# Altium schematic sheet Interface_gratis.SchDoc: CONTROLADORA MAIS PIPOCA - REVISÃO EMC
size A3; DocumentNumber: GA0078; SheetNumber: 17; SheetTotal: 17
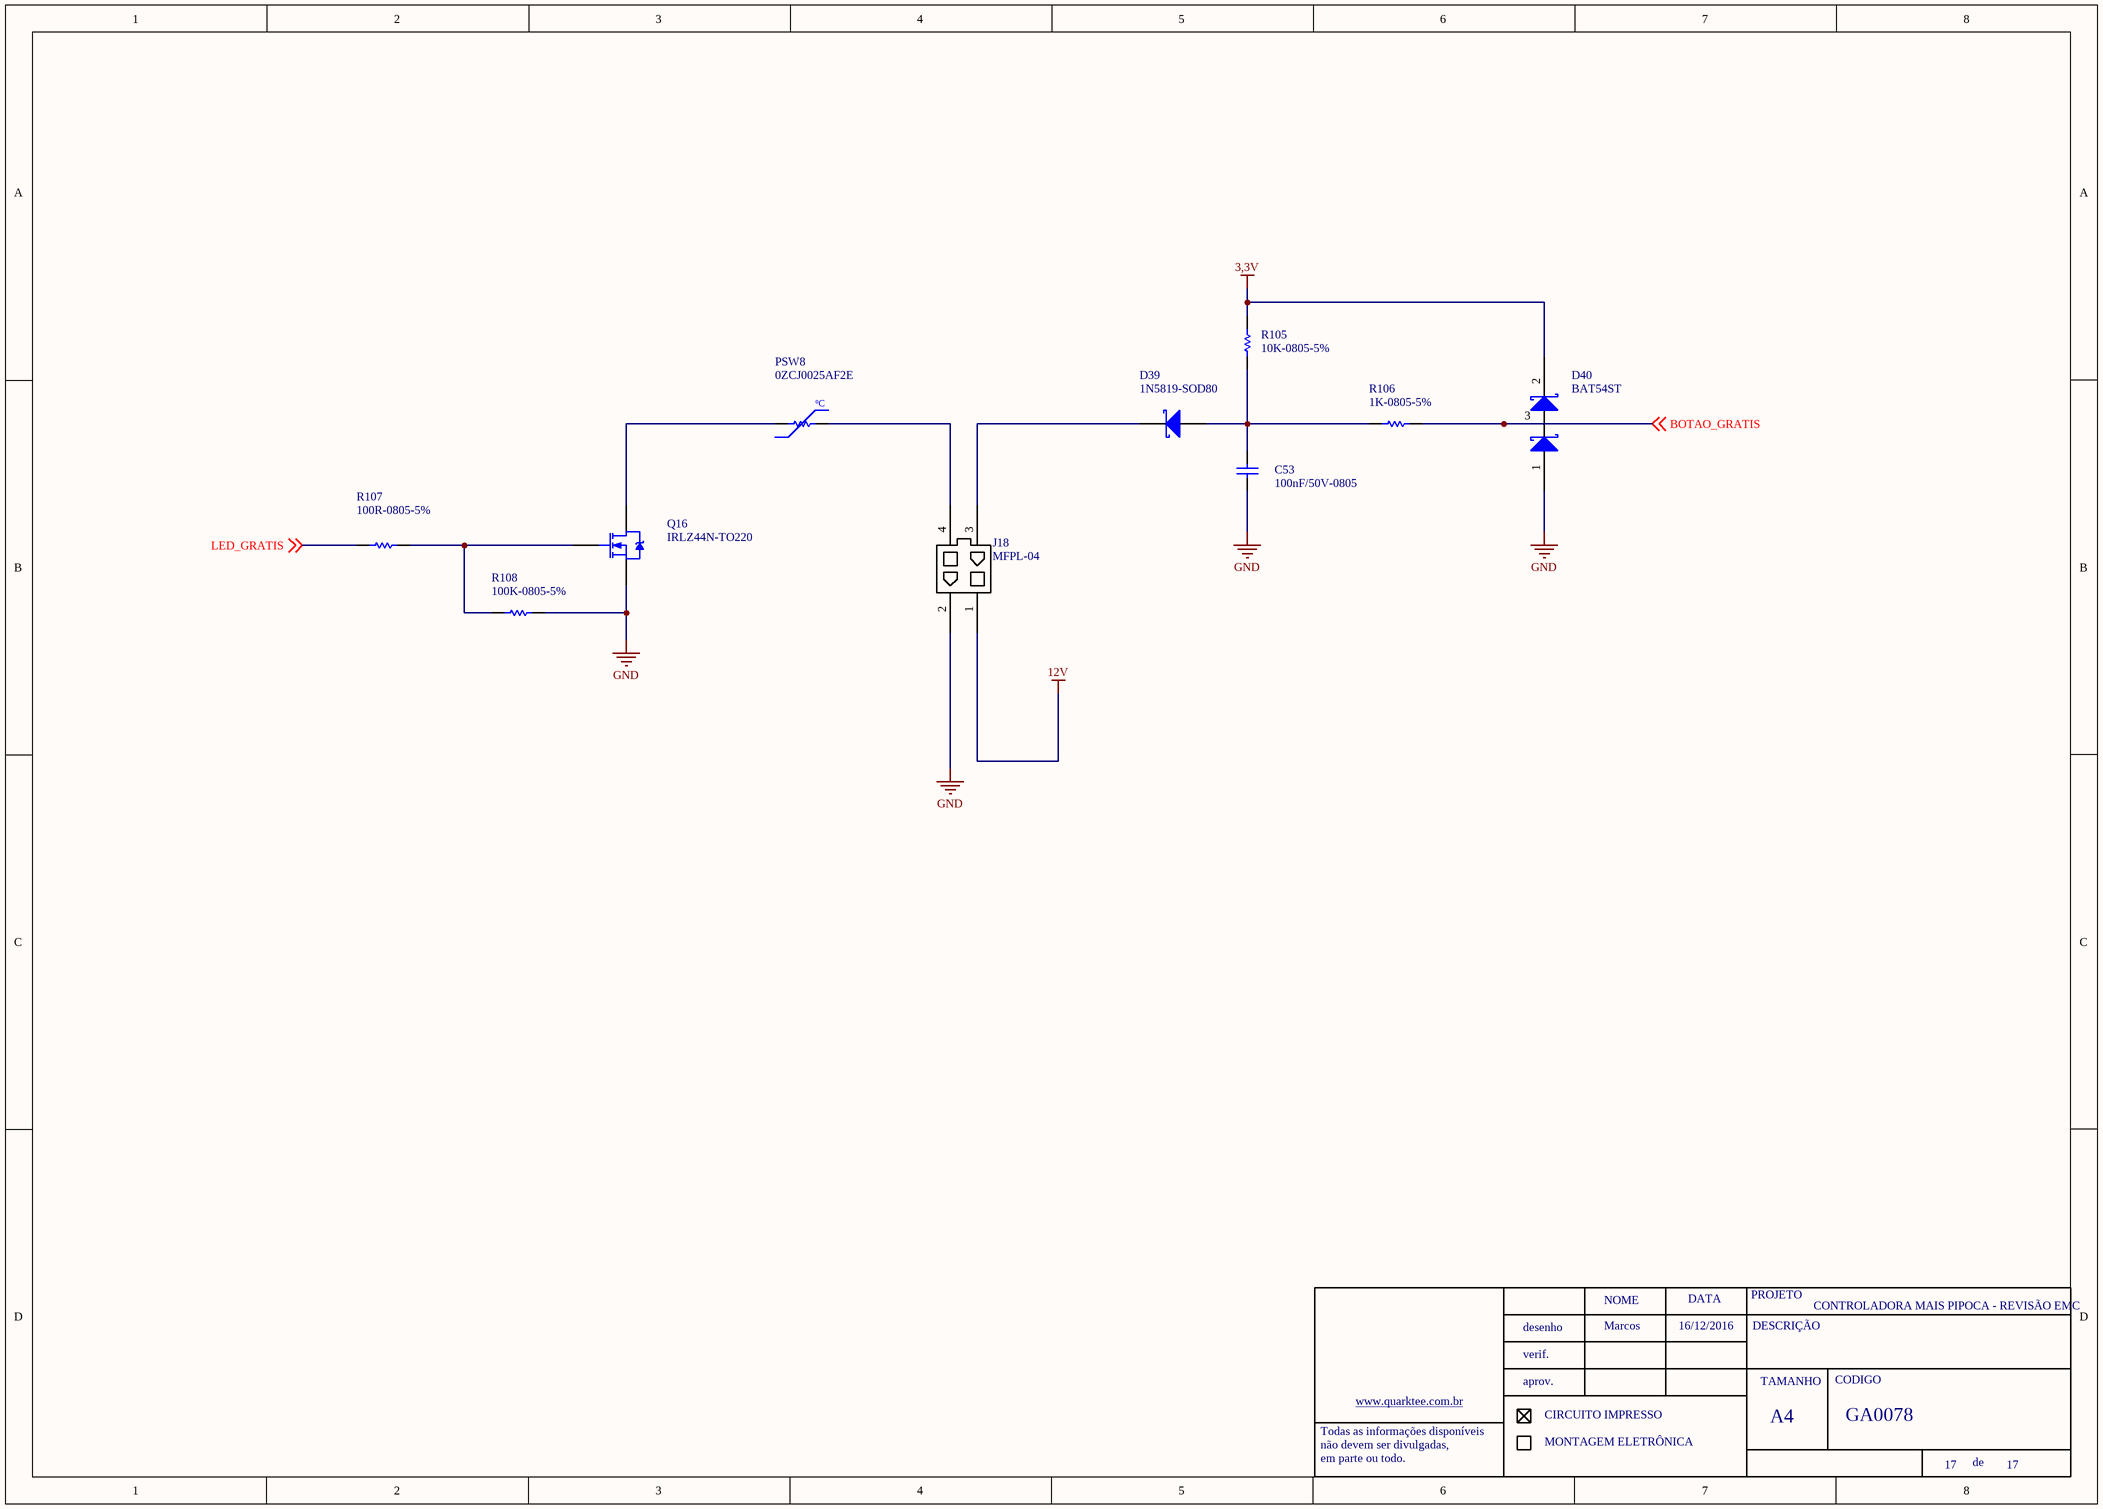
[diagram p0: Interface_gratis.SchDoc]

## Parts
C53  100nF/50V-0805  [0805-REVISADO ONDA]
D39  1N5819-SOD80  [MINIMLEF/SOD80 - REVISADO ONDA]
D40  BAT54ST  [SOT23 - REVISADO ONDA]
J18  MFPL-04
PSW8  0ZCJ0025AF2E  [1206-REVISADO ONDA]
Q16  IRLZ44N-TO220  [TO220-3 EM PÉ]
R105  10K-0805-5%  [0805-REVISADO ONDA]
R106  1K-0805-5%  [0805-REVISADO ONDA]
R107  100R-0805-5%  [0805-REVISADO ONDA]
R108  100K-0805-5%  [0805-REVISADO ONDA]

## Nets
3,3V: D40.2 R105.2
12V: J18.1
GND: C53.1 D40.1 J18.2 Q16.3(S) R108.2
BOTAO_GRATIS: D40.3 R106.2 ; off-sheet BOTAO_GRATIS
LED_GRATIS: R107.1 ; off-sheet LED_GRATIS
NetC53_2: C53.2 D39.1(A) R105.1 R106.1
NetD39_2: D39.2(K) J18.3
NetJ18_4: J18.4 PSW8.2
NetPSW8_1: PSW8.1 Q16.2(D)
NetQ16_1: Q16.1(G) R107.2 R108.1

## Notes on the sheet
- Marcos
- 16/12/2016
- NOME
- DATA
- PROJETO
- DESCRIÇÃO
- desenho
- verif.
- aprov.
- TAMANHO
- CODIGO
- Todas as informações disponíveis
- não devem ser divulgadas,
- em parte ou todo.
- www.quarktee.com.br
- CIRCUITO IMPRESSO
- MONTAGEM ELETRÔNICA
- A4
- de
- (in symbol PTC 2A-120V) ºC

## Library data of the parts
C53 = 100nF/50-0805-NPO: ERP: 104.11.005
PSW8 = PTC 2A-120V
D39 = 1N5819-SOD80: ERP: 121.18.003
Q16 = IRLZ44N-TO220: ERP: 107.01.006
R105 = 10K-0805-5%: ERP: 102.11.054
R106 = 1K-0805-5%: ERP: 102.11.042
R107 = 100R-0805-5%: ERP: 102.11.031
R108 = 100K-0805-5%: ERP: 102.11.066